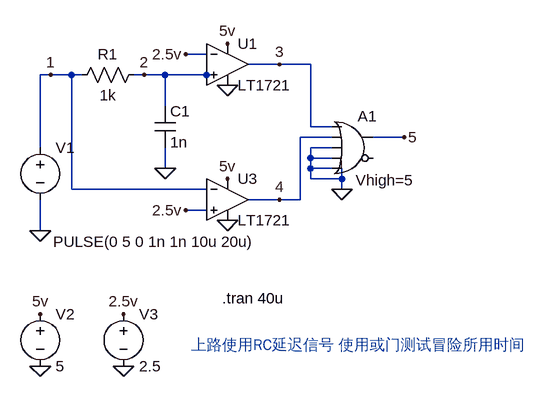
[diagram p0: schematic Draft1.asc]
Draft1.asc, the LTspice schematic file:
Version 4
SHEET 1 880 680
WIRE 368 80 336 80
WIRE 480 96 432 96
WIRE 528 96 480 96
WIRE 128 112 112 112
WIRE 160 112 128 112
WIRE 176 112 160 112
WIRE 272 112 256 112
WIRE 304 112 272 112
WIRE 368 112 304 112
WIRE 384 112 368 112
WIRE 304 160 304 112
WIRE 528 192 528 96
WIRE 560 192 528 192
WIRE 560 208 512 208
WIRE 672 208 624 208
WIRE 112 224 112 112
WIRE 560 224 528 224
WIRE 528 240 528 224
WIRE 560 240 528 240
WIRE 304 256 304 224
WIRE 528 256 528 240
WIRE 560 256 528 256
WIRE 528 272 528 256
WIRE 576 272 576 256
WIRE 576 272 528 272
WIRE 160 288 160 112
WIRE 368 288 160 288
WIRE 576 288 576 272
WIRE 480 304 432 304
WIRE 512 304 512 208
WIRE 512 304 480 304
WIRE 368 320 336 320
WIRE 112 352 112 304
FLAG 304 256 0
FLAG 400 128 0
FLAG 400 336 0
FLAG 112 560 0
FLAG 240 560 0
FLAG 112 480 5v
FLAG 240 480 2.5v
FLAG 400 64 5v
FLAG 400 272 5v
FLAG 336 80 2.5v
FLAG 336 320 2.5v
FLAG 112 352 0
FLAG 576 288 0
FLAG 672 208 5
FLAG 128 112 1
FLAG 272 112 2
FLAG 480 96 3
FLAG 480 304 4
SYMBOL Voltage 112 208 R0
WINDOW 3 20 161 Left 2
SYMATTR InstName V1
SYMATTR Value PULSE(0 5 0 1n 1n 10u 20u)
SYMBOL Res 272 96 R90
WINDOW 0 0 56 VBottom 2
WINDOW 3 32 56 VTop 2
SYMATTR InstName R1
SYMATTR Value 1k
SYMBOL Comparators/LT1721 400 32 R0
SYMATTR InstName U1
SYMBOL Comparators/LT1721 400 240 R0
SYMATTR InstName U3
SYMBOL Cap 288 160 R0
SYMATTR InstName C1
SYMATTR Value 1n
SYMBOL Digital/or 592 160 R0
WINDOW 3 5 114 Left 2
SYMATTR InstName A1
SYMATTR Value Vhigh=5
SYMBOL Voltage 112 464 R0
SYMATTR InstName V2
SYMATTR Value 5
SYMBOL Voltage 240 464 R0
SYMATTR InstName V3
SYMATTR Value 2.5
TEXT 392 456 Left 2 !.tran 40u
TEXT 344 528 Left 2 ;上路使用RC延迟信号 使用或门测试冒险所用时间

The netlist it stands for:
* Draft1.asc
V1 1 0 PULSE(0 5 0 1n 1n 10u 20u)
R1 2 1 1k
XU1 2 2.5v 5v 0 3 LT1720  ; LT1721, pins In+ In- V+ V- OUT
XU3 2.5v 1 5v 0 4 LT1720  ; LT1721, pins In+ In- V+ V- OUT
C1 2 0 1n
A1 3 4 0 0 0 0 5 0 OR Vhigh=5
V2 5v 0 5
V3 2.5v 0 2.5
.tran 40u
* 上路使用RC延迟信号 使用或门测试冒险所用时间
.lib LTC.lib
.backanno
.end